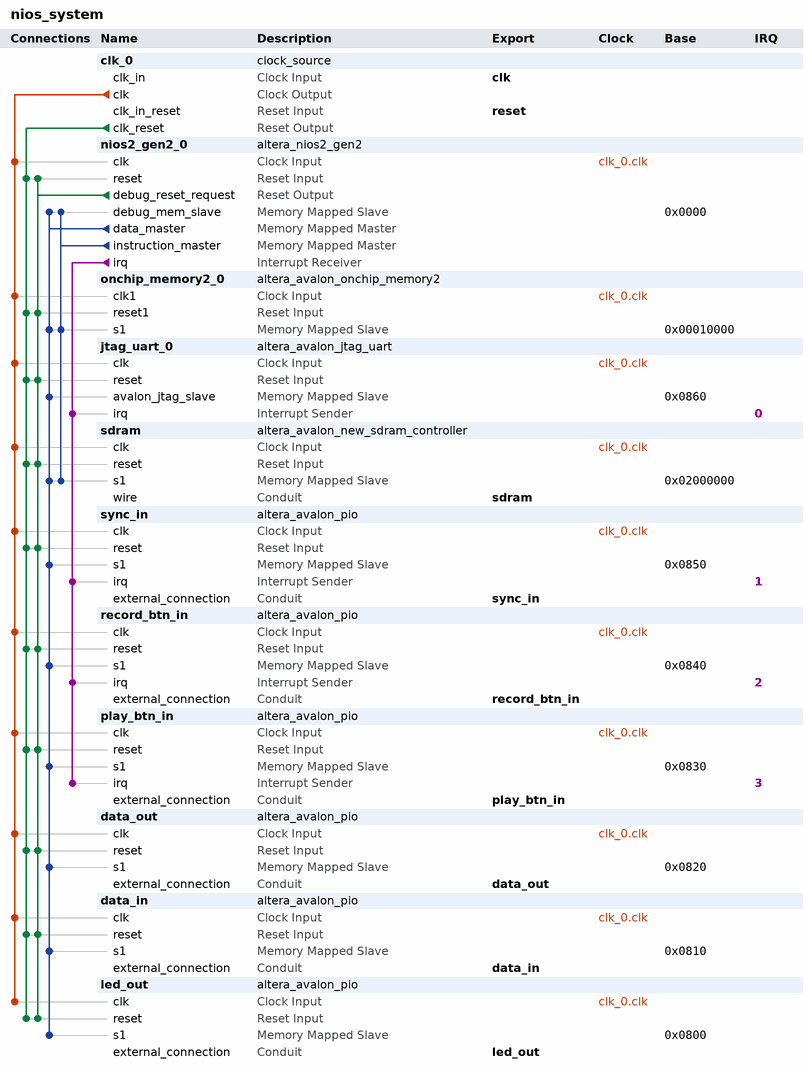
[diagram p0: system contents]
# Platform Designer (Qsys) system nios_system, Cyclone V 5CSEMA5F31C6
# Parameters at their usual value, and those the tool derives, are not listed.
package require -exact qsys 16.1
create_system nios_system
set_project_property DEVICE_FAMILY {Cyclone V}
set_project_property DEVICE 5CSEMA5F31C6

add_instance clk_0 clock_source 16.1
set_instance_parameter_value clk_0 clockFrequency 50000000

add_instance nios2_gen2_0 altera_nios2_gen2 16.1
set_instance_parameter_value nios2_gen2_0 dcache_size 2048
set_instance_parameter_value nios2_gen2_0 exceptionSlave sdram.s1
set_instance_parameter_value nios2_gen2_0 icache_size 4096
set_instance_parameter_value nios2_gen2_0 impl Tiny
set_instance_parameter_value nios2_gen2_0 resetSlave sdram.s1

add_instance onchip_memory2_0 altera_avalon_onchip_memory2 16.1
set_instance_parameter_value onchip_memory2_0 dataWidth 32
set_instance_parameter_value onchip_memory2_0 dualPort false
set_instance_parameter_value onchip_memory2_0 initMemContent true
set_instance_parameter_value onchip_memory2_0 initializationFileName onchip_mem.hex
set_instance_parameter_value onchip_memory2_0 memorySize 32768

add_instance jtag_uart_0 altera_avalon_jtag_uart 16.1
set_instance_parameter_value jtag_uart_0 simInteractiveOptions NO_INTERACTIVE_WINDOWS

add_instance sdram altera_avalon_new_sdram_controller 16.1
set_instance_parameter_value sdram TAC 5.5
set_instance_parameter_value sdram TRCD 20.0
set_instance_parameter_value sdram TRP 20.0
set_instance_parameter_value sdram casLatency 3
set_instance_parameter_value sdram columnWidth 8
set_instance_parameter_value sdram dataWidth 16
set_instance_parameter_value sdram generateSimulationModel false
set_instance_parameter_value sdram model single_Micron_MT48LC4M32B2_7_chip
set_instance_parameter_value sdram numberOfBanks 4
set_instance_parameter_value sdram numberOfChipSelects 1
set_instance_parameter_value sdram powerUpDelay 100.0
set_instance_parameter_value sdram refreshPeriod 15.625
set_instance_parameter_value sdram rowWidth 12

add_instance sync_in altera_avalon_pio 16.1
set_instance_parameter_value sync_in captureEdge true
set_instance_parameter_value sync_in direction Input
set_instance_parameter_value sync_in generateIRQ true
set_instance_parameter_value sync_in irqType EDGE
set_instance_parameter_value sync_in width 1

add_instance record_btn_in altera_avalon_pio 16.1
set_instance_parameter_value record_btn_in captureEdge true
set_instance_parameter_value record_btn_in direction Input
set_instance_parameter_value record_btn_in generateIRQ true
set_instance_parameter_value record_btn_in irqType EDGE
set_instance_parameter_value record_btn_in width 1

add_instance play_btn_in altera_avalon_pio 16.1
set_instance_parameter_value play_btn_in captureEdge true
set_instance_parameter_value play_btn_in direction Input
set_instance_parameter_value play_btn_in generateIRQ true
set_instance_parameter_value play_btn_in irqType EDGE
set_instance_parameter_value play_btn_in width 1

add_instance data_out altera_avalon_pio 16.1
set_instance_parameter_value data_out direction Output
set_instance_parameter_value data_out width 16

add_instance data_in altera_avalon_pio 16.1
set_instance_parameter_value data_in direction Input
set_instance_parameter_value data_in width 16

add_instance led_out altera_avalon_pio 16.1
set_instance_parameter_value led_out direction Output
set_instance_parameter_value led_out width 10

# connections
add_connection clk_0.clk data_in.clk clock
add_connection clk_0.clk data_out.clk clock
add_connection clk_0.clk jtag_uart_0.clk clock
add_connection clk_0.clk led_out.clk clock
add_connection clk_0.clk nios2_gen2_0.clk clock
add_connection clk_0.clk onchip_memory2_0.clk1 clock
add_connection clk_0.clk play_btn_in.clk clock
add_connection clk_0.clk record_btn_in.clk clock
add_connection clk_0.clk sdram.clk clock
add_connection clk_0.clk sync_in.clk clock
add_connection clk_0.clk_reset data_in.reset reset
add_connection clk_0.clk_reset data_out.reset reset
add_connection clk_0.clk_reset jtag_uart_0.reset reset
add_connection clk_0.clk_reset led_out.reset reset
add_connection clk_0.clk_reset nios2_gen2_0.reset reset
add_connection clk_0.clk_reset onchip_memory2_0.reset1 reset
add_connection clk_0.clk_reset play_btn_in.reset reset
add_connection clk_0.clk_reset record_btn_in.reset reset
add_connection clk_0.clk_reset sdram.reset reset
add_connection clk_0.clk_reset sync_in.reset reset
add_connection nios2_gen2_0.debug_reset_request data_in.reset reset
add_connection nios2_gen2_0.debug_reset_request data_out.reset reset
add_connection nios2_gen2_0.debug_reset_request jtag_uart_0.reset reset
add_connection nios2_gen2_0.debug_reset_request led_out.reset reset
add_connection nios2_gen2_0.debug_reset_request nios2_gen2_0.reset reset
add_connection nios2_gen2_0.debug_reset_request onchip_memory2_0.reset1 reset
add_connection nios2_gen2_0.debug_reset_request play_btn_in.reset reset
add_connection nios2_gen2_0.debug_reset_request record_btn_in.reset reset
add_connection nios2_gen2_0.debug_reset_request sdram.reset reset
add_connection nios2_gen2_0.debug_reset_request sync_in.reset reset
add_connection nios2_gen2_0.data_master data_in.s1 avalon
set_connection_parameter_value nios2_gen2_0.data_master/data_in.s1 baseAddress 0x0810
add_connection nios2_gen2_0.data_master data_out.s1 avalon
set_connection_parameter_value nios2_gen2_0.data_master/data_out.s1 baseAddress 0x0820
add_connection nios2_gen2_0.data_master jtag_uart_0.avalon_jtag_slave avalon
set_connection_parameter_value nios2_gen2_0.data_master/jtag_uart_0.avalon_jtag_slave baseAddress 0x0860
add_connection nios2_gen2_0.data_master led_out.s1 avalon
set_connection_parameter_value nios2_gen2_0.data_master/led_out.s1 baseAddress 0x0800
add_connection nios2_gen2_0.data_master nios2_gen2_0.debug_mem_slave avalon
set_connection_parameter_value nios2_gen2_0.data_master/nios2_gen2_0.debug_mem_slave baseAddress 0x0000
add_connection nios2_gen2_0.data_master onchip_memory2_0.s1 avalon
set_connection_parameter_value nios2_gen2_0.data_master/onchip_memory2_0.s1 baseAddress 0x00010000
add_connection nios2_gen2_0.data_master play_btn_in.s1 avalon
set_connection_parameter_value nios2_gen2_0.data_master/play_btn_in.s1 baseAddress 0x0830
add_connection nios2_gen2_0.data_master record_btn_in.s1 avalon
set_connection_parameter_value nios2_gen2_0.data_master/record_btn_in.s1 baseAddress 0x0840
add_connection nios2_gen2_0.data_master sdram.s1 avalon
set_connection_parameter_value nios2_gen2_0.data_master/sdram.s1 baseAddress 0x02000000
add_connection nios2_gen2_0.data_master sync_in.s1 avalon
set_connection_parameter_value nios2_gen2_0.data_master/sync_in.s1 baseAddress 0x0850
add_connection nios2_gen2_0.instruction_master nios2_gen2_0.debug_mem_slave avalon
set_connection_parameter_value nios2_gen2_0.instruction_master/nios2_gen2_0.debug_mem_slave baseAddress 0x0000
add_connection nios2_gen2_0.instruction_master onchip_memory2_0.s1 avalon
set_connection_parameter_value nios2_gen2_0.instruction_master/onchip_memory2_0.s1 baseAddress 0x00010000
add_connection nios2_gen2_0.instruction_master sdram.s1 avalon
set_connection_parameter_value nios2_gen2_0.instruction_master/sdram.s1 baseAddress 0x02000000
add_connection nios2_gen2_0.irq jtag_uart_0.irq interrupt
set_connection_parameter_value nios2_gen2_0.irq/jtag_uart_0.irq irqNumber 0
add_connection nios2_gen2_0.irq play_btn_in.irq interrupt
set_connection_parameter_value nios2_gen2_0.irq/play_btn_in.irq irqNumber 3
add_connection nios2_gen2_0.irq record_btn_in.irq interrupt
set_connection_parameter_value nios2_gen2_0.irq/record_btn_in.irq irqNumber 2
add_connection nios2_gen2_0.irq sync_in.irq interrupt
set_connection_parameter_value nios2_gen2_0.irq/sync_in.irq irqNumber 1

# exported interfaces
add_interface clk clock sink
set_interface_property clk EXPORT_OF clk_0.clk_in
add_interface data_in conduit end
set_interface_property data_in EXPORT_OF data_in.external_connection
add_interface data_out conduit end
set_interface_property data_out EXPORT_OF data_out.external_connection
add_interface led_out conduit end
set_interface_property led_out EXPORT_OF led_out.external_connection
add_interface play_btn_in conduit end
set_interface_property play_btn_in EXPORT_OF play_btn_in.external_connection
add_interface record_btn_in conduit end
set_interface_property record_btn_in EXPORT_OF record_btn_in.external_connection
add_interface reset reset sink
set_interface_property reset EXPORT_OF clk_0.clk_in_reset
add_interface sdram conduit end
set_interface_property sdram EXPORT_OF sdram.wire
add_interface sync_in conduit end
set_interface_property sync_in EXPORT_OF sync_in.external_connection

set_interconnect_requirement {$system} qsys_mm.clockCrossingAdapter HANDSHAKE
set_interconnect_requirement {$system} qsys_mm.enableEccProtection FALSE
set_interconnect_requirement {$system} qsys_mm.insertDefaultSlave FALSE
set_interconnect_requirement {$system} qsys_mm.maxAdditionalLatency 1

save_system nios_system.qsys
